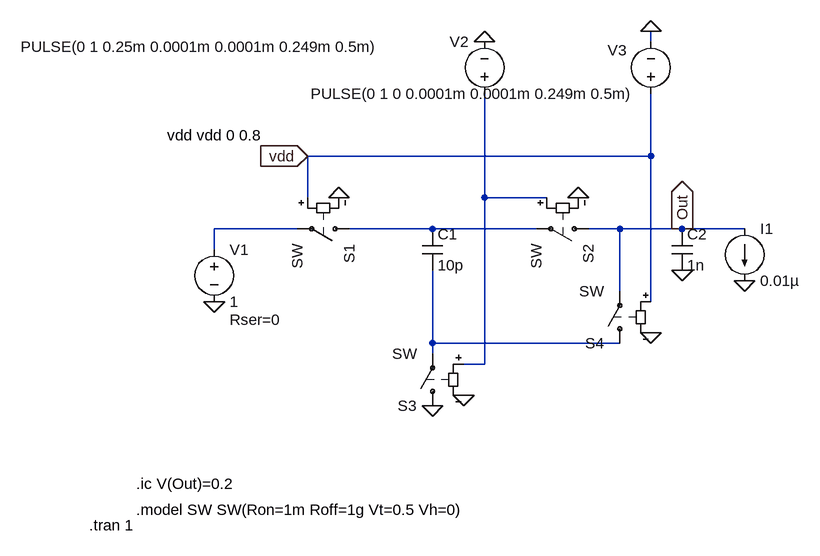
[diagram p0: schematic two_caps_four_swchs.asc]
two_caps_four_swchs.asc, the LTspice schematic file:
Version 4
SHEET 1 1780 680
WIRE 736 -208 736 -224
WIRE 736 -32 736 -128
WIRE 736 -32 208 -32
WIRE 208 32 208 -32
WIRE 480 32 480 -128
WIRE 576 32 480 32
WIRE 192 80 64 80
WIRE 400 80 272 80
WIRE 560 80 400 80
WIRE 688 80 640 80
WIRE 784 80 688 80
WIRE 880 80 784 80
WIRE 64 112 64 80
WIRE 688 176 688 80
WIRE 736 192 736 -32
WIRE 400 256 400 144
WIRE 688 256 400 256
WIRE 400 272 400 256
WIRE 480 288 480 32
WIRE 480 288 448 288
FLAG 480 -208 0
FLAG 736 -224 0
FLAG 64 192 0
FLAG 784 144 0
FLAG 400 352 0
FLAG 448 336 0
FLAG 256 32 0
FLAG 624 32 0
FLAG 736 240 0
FLAG 880 160 0
FLAG 784 80 Out
IOPIN 784 80 Out
FLAG 208 -32 vdd
IOPIN 208 -32 In
SYMBOL voltage 64 96 R0
WINDOW 123 0 0 Left 2
WINDOW 39 24 124 Left 2
SYMATTR SpiceLine Rser=0
SYMATTR InstName V1
SYMATTR Value 1
SYMBOL sw 288 80 R90
SYMATTR InstName S1
SYMBOL sw 656 80 R90
SYMATTR InstName S2
SYMBOL sw 400 368 R180
SYMATTR InstName S3
SYMBOL cap 384 80 R0
SYMATTR InstName C1
SYMATTR Value 10p
SYMBOL cap 768 80 R0
SYMATTR InstName C2
SYMATTR Value 1n
SYMBOL voltage 480 -112 R180
WINDOW 0 24 96 Left 2
WINDOW 3 160 88 Left 2
WINDOW 123 0 0 Left 2
WINDOW 39 0 0 Left 2
SYMATTR InstName V2
SYMATTR Value PULSE(0 1 0.25m 0.0001m 0.0001m 0.249m 0.5m)
SYMBOL voltage 736 -112 R180
WINDOW 0 37 83 Left 2
WINDOW 3 24 16 Left 2
WINDOW 123 0 0 Left 2
WINDOW 39 0 0 Left 2
SYMATTR InstName V3
SYMATTR Value PULSE(0 1 0 0.0001m 0.0001m 0.249m 0.5m)
SYMBOL sw 688 272 R180
SYMATTR InstName S4
SYMBOL current 880 80 R0
WINDOW 123 0 0 Left 2
WINDOW 39 0 0 Left 2
SYMATTR InstName I1
SYMATTR Value 0.01µ
TEXT -56 512 Left 2 !.model SW SW(Ron=1m Roff=1g Vt=0.5 Vh=0)
TEXT -56 472 Left 2 !.ic V(Out)=0.2
TEXT -128 536 Left 2 !.tran 1
TEXT -8 -64 Left 2 !vdd vdd 0 0.8

The netlist it stands for:
* two_caps_four_swchs.asc
V1 N002 0 1 Rser=0
S1 N003 N002 vdd 0 SW
S2 Out N003 N001 0 SW
S3 0 N004 N001 0 SW
C1 N003 N004 10p
C2 Out 0 1n
V2 N001 0 PULSE(0 1 0.25m 0.0001m 0.0001m 0.249m 0.5m)
V3 vdd 0 PULSE(0 1 0 0.0001m 0.0001m 0.249m 0.5m)
S4 N004 Out vdd 0 SW
I1 Out 0 0.01µ
.model SW SW(Ron=1m Roff=1g Vt=0.5 Vh=0)
.ic V(Out)=0.2
.tran 1
vdd vdd 0 0.8
.backanno
.end